# EAGLE design iGlass Ext v1 (EAGLE 9.6.2)
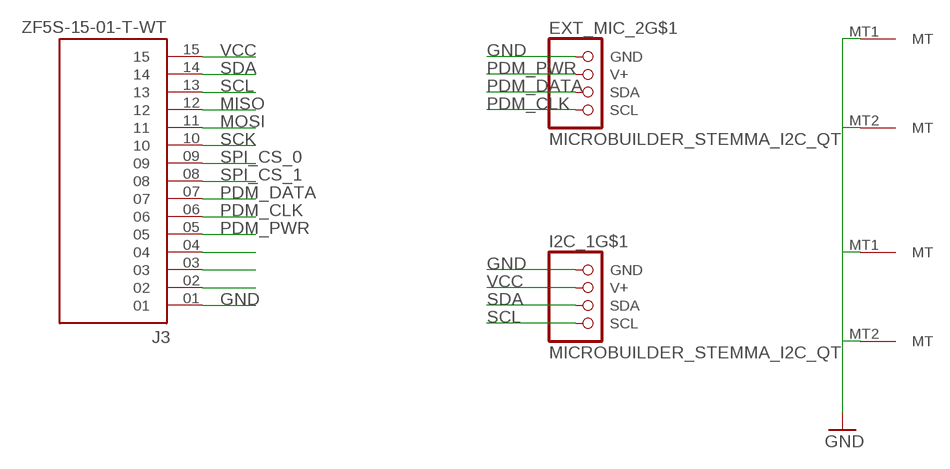
[diagram p0: schematic, sheet 1]

## Parts
EXT_MIC_2  MICROBUILDER_STEMMA_I2C_QT  [MICROBUILDER_JST_SH4]
I2C_1  MICROBUILDER_STEMMA_I2C_QT  [MICROBUILDER_JST_SH4]
J3  ZF5S-15-01-T-WT  [SAMTEC_ZF5S-15-01-T-WT]

## Nets
GND: EXT_MIC_2.1(GND) EXT_MIC_2.MT1(MT) EXT_MIC_2.MT2(MT) I2C_1.1(GND) I2C_1.MT1(MT) I2C_1.MT2(MT) J3.01
MISO: J3.12
MOSI: J3.11
N$3: J3.04
N$4: J3.03
N$5: J3.02
PDM_CLK: EXT_MIC_2.4(SCL) J3.06
PDM_DATA: EXT_MIC_2.3(SDA) J3.07
PDM_PWR: EXT_MIC_2.2(V+) J3.05
SCK: J3.10
SCL: I2C_1.4(SCL) J3.13
SDA: I2C_1.3(SDA) J3.14
SPI_CS_0: J3.09
SPI_CS_1: J3.08
VCC: I2C_1.2(V+) J3.15

## Library data of the parts
EXT_MIC_2 I2C_1 = smart-glasses:MICROBUILDER_STEMMA_I2C
J3 = ZF5S-15-01-T-WT:ZF5S-15-01-T-WT; MANUFACTURER: SAMTEC

## Board
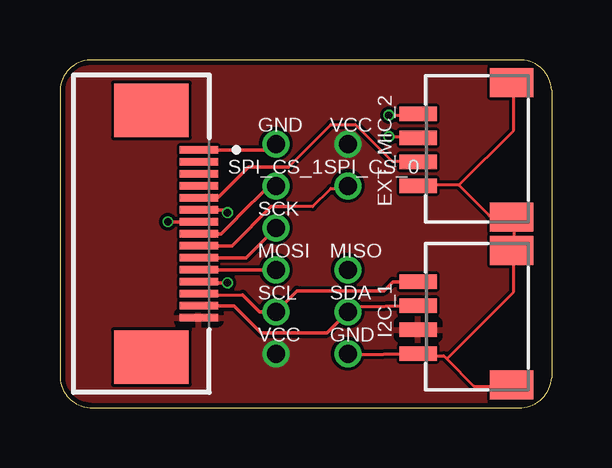
[diagram p1: board, top side]
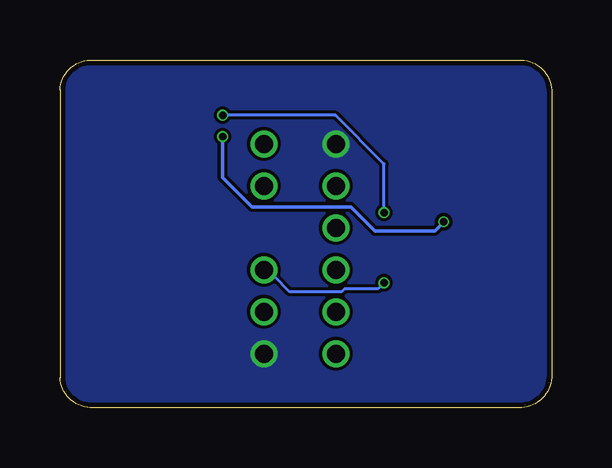
[diagram p2: board, bottom side, seen from below]

Size 20.5 x 14.5 mm. Coordinates in mm from the lower left corner, seen from the top.
Outline: 1.25,0 19.25,0 arc84 20.5,1.25 20.5,13.25 arc84 19.25,14.5 1.25,14.5 arc84 0,13.25 0,1.25 arc84 1.25,0
Copper layers (1*16): Top 0.035559375mm / dielectric 1.6mm / Bottom 0.035559375mm
Design rules "jlcpcb2layer": minimum track width 5mil, minimum drill 12mil, track to track 5mil, track to pad 5mil, pad to pad 5mil, via to via 5mil, smd to smd 5mil, copper to edge 8mil, drill to drill 6mil, minimum pad ring 5mil, minimum via ring 3mil, stop-mask expansion 2.5mil, vias tented up to drill 0mil, thermal gap 10mil

### Footprints (pad centres in the part's own frame; a part is rotated, then mirrored left to right if it is on the bottom)
MICROBUILDER_JST_SH4 = smd 0.6 x 1.55: 1 -1.5,2.514; 2 -0.5,2.514; 3 0.5,2.514; 4 1.5,2.514 | smd 1.2 x 1.8: MT1 -2.8,-1.386; MT2 2.8,-1.386
SAMTEC_ZF5S-15-01-T-WT = smd 0.3 x 1.6: 01 -3.5,1.98; 02 -3,1.98; 03 -2.5,1.98; 04 -2,1.98; 05 -1.5,1.98; 06 -1,1.98; 07 -0.5,1.98; 08 0,1.98; 09 0.5,1.98; 10 1,1.98; 11 1.5,1.98; 12 2,1.98; 13 2.5,1.98; 14 3,1.98; 15 3.5,1.98 | smd 2.24 x 3.12: S1 -5.147,0; S2 5.147,0

### Placement (x,y rotation side)
EXT_MIC_2  17.45,10.75 90 top
I2C_1  17.45,3.75 90 top
J3  3.81,7.25 270 top

### Tracks (layer width: path | path; a pad name or v marks a point on that pad's centre or on a via)
GND  (via drill 0.75)
  Top 0.127: 16.63,9.27 14.98,9.27 EXT_MIC_2.1 | 16.63,9.27 17.9,8 18.79,8 EXT_MIC_2.MT1 18.92,7.87 18.92,6.6 I2C_1.MT2 18.92,6.48 18.92,4.83 16.12,2.03 | 16.63,9.27 18.92,11.56 18.92,13.46 EXT_MIC_2.MT2 | 16.12,2.03 16,2.16 14.98,2.16 I2C_1.1 | 16.12,2.03 17.27,0.89 18.79,0.89 I2C_1.MT1
  Top 0.152: J3.01 8.75,10.75 v9,11 | I2C_1.1 12.05,2.2 v12,2.25
  pour Bottom: -1.75,16 -1.75,-1 22.25,-1 22.25,16
MISO  (via drill 0.3, 0.75)
  Top 0.152: v6.98,5.21 5.83,5.21 J3.12
  Bottom 0.127: v6.98,5.21 7.24,4.95 8.63,4.95 8.76,4.83 10.92,4.83 11.55,5.46 11.68,5.46 11.93,5.71 v12,5.75
MOSI  (via drill 0.75)
  Top 0.152: J3.11 v9,5.75
PDM_CLK  (via drill 0.3)
  Top 0.127: v13.71,12.19 14.86,12.19 EXT_MIC_2.4
  Top 0.152: J3.06 6.86,8.25 v6.98,8.13
  Bottom 0.127: v13.71,12.19 9.01,12.19 6.98,10.16 v6.98,8.13
PDM_DATA  (via drill 0.3)
  Top 0.127: v13.71,11.3 14.86,11.3 EXT_MIC_2.3
  Top 0.152: J3.07 v4.5,7.75
  Bottom 0.152: v4.5,7.75 4.88,7.38 7.38,7.38 8.38,8.38 12.5,8.38 13.71,9.59 v13.71,11.3
PDM_PWR
  Top 0.127: 9.52,10.03 11.3,11.81 12.31,11.81 13.84,10.29 14.86,10.29 EXT_MIC_2.2 | 6.6,8.76 5.84,8.76 J3.05
  Top 0.152: 9.52,10.03 7.87,10.03 6.6,8.76
SCK  (via drill 0.75)
  Top 0.152: v9,7.5 7.75,6.25 J3.10
SCL  (via drill 0.75)
  Top 0.127: 7.62,4.7 5.84,4.7 J3.13 | 14.86,5.21 I2C_1.4
  Top 0.152: 7.62,4.7 8.31,4 v9,4 9.88,4.88 13.5,4.88 13.88,5.25 14.81,5.25 14.86,5.21
SDA  (via drill 0.75)
  Top 0.152: J3.14 7.25,4.25 8.38,3.12 11.12,3.12 v12,4 12.2,4.2 I2C_1.3
SPI_CS_0  (via drill 0.75)
  Top 0.127: 9.65,8.38 10.54,8.38 11.3,9.14 11.93,9.14 v12,9.25
  Top 0.152: J3.09 7.17,6.75 8.8,8.38 9.65,8.38
SPI_CS_1  (via drill 0.75)
  Top 0.152: J3.08 6.71,7.25 7.36,7.89 7.41,7.95 8.71,9.25 v9,9.25
VCC  (via drill 0.75)
  other vias: 9,2.25 12,11
  pour Top: -0.75,15 -0.75,0 21.25,0 21.25,15

### Text on the board
tPlace: GND | VCC | SPI_CS_1 | SPI_CS_0 | SCK | MOSI | MISO | SCL | SDA | VCC | GND